# Altium schematic sheet KA2_3.SchDoc
size 420 x 297 mm; SheetNumber: 3; SheetTotal: 6
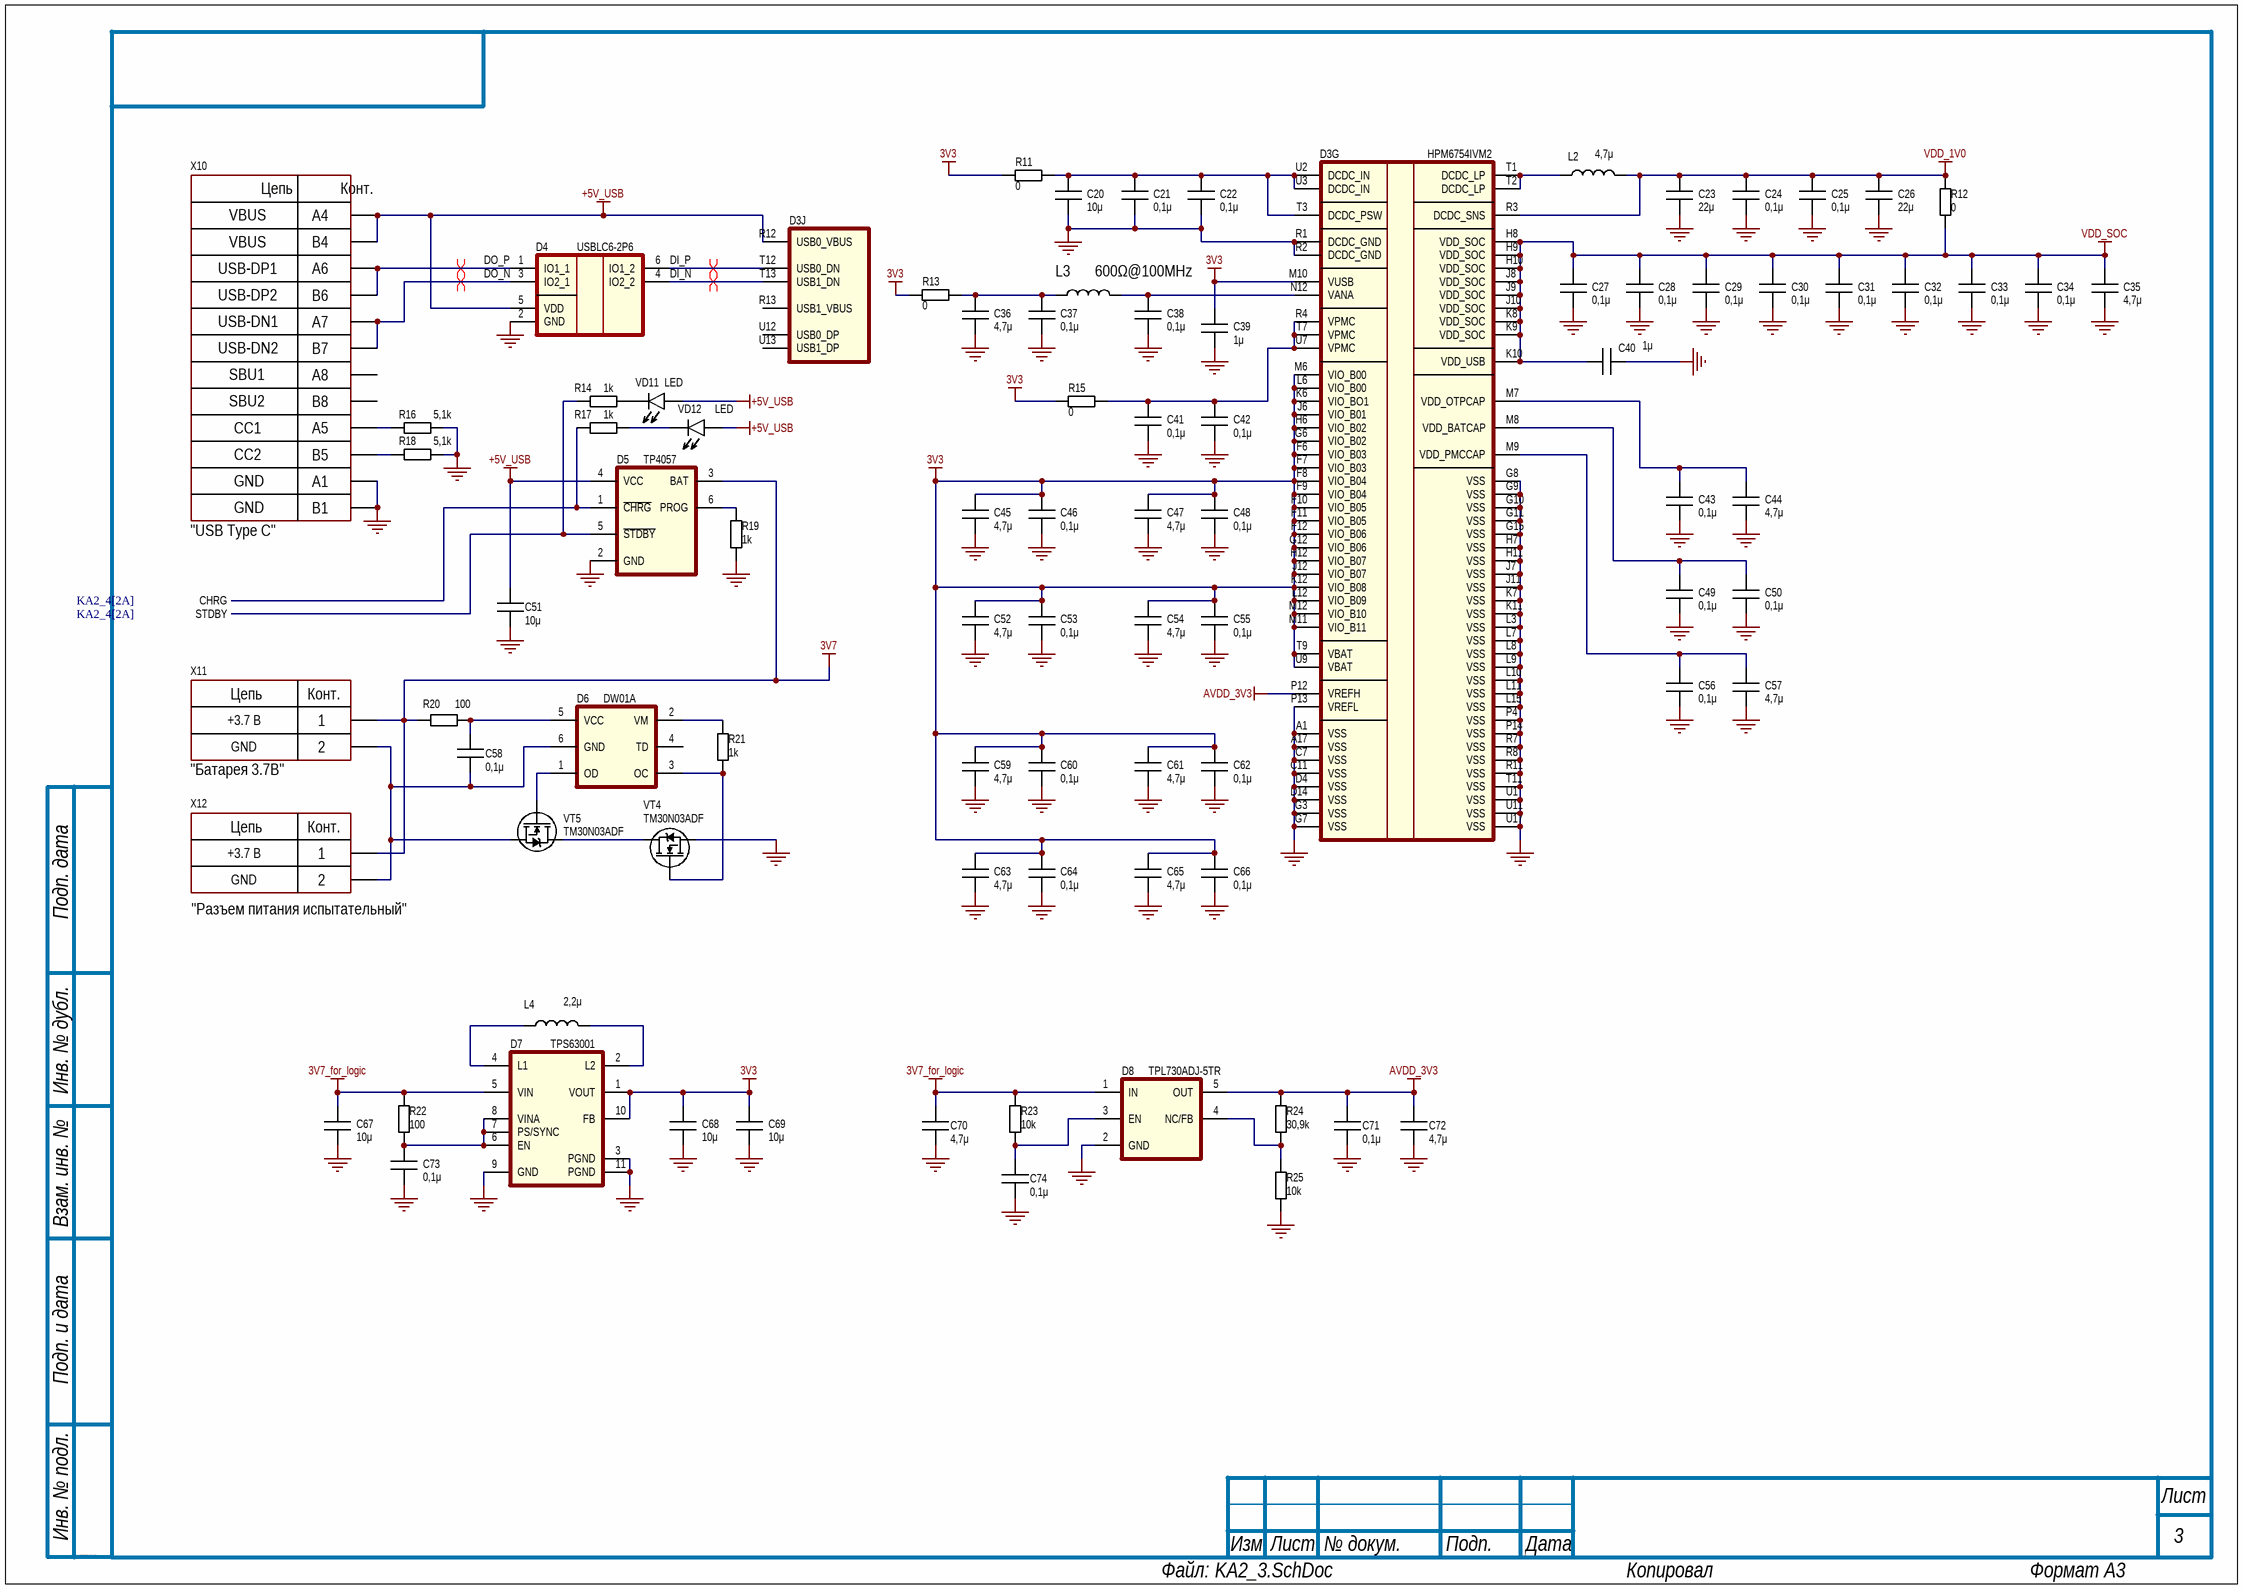
[diagram p0: KA2_3.SchDoc]

## Parts
C20  value 10μ  [Capacitor_0402]
C21  value 0,1μ  [Capacitor_0402]
C22  value 0,1μ  [Capacitor_0402]
C23  value 22μ  [Capacitor_0402]
C24  value 0,1μ  [Capacitor_0402]
C25  value 0,1μ  [Capacitor_0402]
C26  value 22μ  [Capacitor_0402]
C27  value 0,1μ  [Capacitor_0402]
C28  value 0,1μ  [Capacitor_0402]
C29  value 0,1μ  [Capacitor_0402]
C30  value 0,1μ  [Capacitor_0402]
C31  value 0,1μ  [Capacitor_0402]
C32  value 0,1μ  [Capacitor_0402]
C33  value 0,1μ  [Capacitor_0402]
C34  value 0,1μ  [Capacitor_0402]
C35  value 4,7μ  [Capacitor_0402]
C36  value 4,7μ  [Capacitor_0402]
C37  value 0,1μ  [Capacitor_0402]
C38  value 0,1μ  [Capacitor_0402]
C39  value 1μ  [Capacitor_0402]
C40  value 1μ  [Capacitor_0402]
C41  value 0,1μ  [Capacitor_0402]
C42  value 0,1μ  [Capacitor_0402]
C43  value 0,1μ  [Capacitor_0402]
C44  value 4,7μ  [Capacitor_0402]
C45  value 4,7μ  [Capacitor_0402]
C46  value 0,1μ  [Capacitor_0402]
C47  value 4,7μ  [Capacitor_0402]
C48  value 0,1μ  [Capacitor_0402]
C49  value 0,1μ  [Capacitor_0402]
C50  value 0,1μ  [Capacitor_0402]
C51  value 10μ  [Capacitor_0402]
C52  value 4,7μ  [Capacitor_0402]
C53  value 0,1μ  [Capacitor_0402]
C54  value 4,7μ  [Capacitor_0402]
C55  value 0,1μ  [Capacitor_0402]
C56  value 0,1μ  [Capacitor_0402]
C57  value 4,7μ  [Capacitor_0402]
C58  value 0,1μ  [Capacitor_0402]
C59  value 4,7μ  [Capacitor_0402]
C60  value 0,1μ  [Capacitor_0402]
C61  value 4,7μ  [Capacitor_0402]
C62  value 0,1μ  [Capacitor_0402]
C63  value 4,7μ  [Capacitor_0402]
C64  value 0,1μ  [Capacitor_0402]
C65  value 4,7μ  [Capacitor_0402]
C66  value 0,1μ  [Capacitor_0402]
C67  value 10μ  [Capacitor_0402]
C68  value 10μ  [Capacitor_0402]
C69  value 10μ  [Capacitor_0402]
C70  value 4,7μ  [Capacitor_0402]
C71  value 0,1μ  [Capacitor_0402]
C72  value 4,7μ  [Capacitor_0402]
C73  value 0,1μ  [Capacitor_0402]
C74  value 0,1μ  [Capacitor_0402]
D3  HPM6754IVM2  [HPM6754IVM2_BGA-289_14x14mm]  (parts G,J of 11)
D4  USBLC6-2P6  [SOT-666]
D5  TP4057  [SOT23-6]
D6  DW01A  [SOT23-6]
D7  TPS63001  [TPS6300x]
D8  value TPL730ADJ-5TR  [SOT-23-5]  (hidden comment: TPL730ADJ-5TL)
L2  value 4,7μ  [Inductor_1008]  (hidden comment: 1.55A 4.7uH ±20% 1.9A 196mΩ Magnetic Shielded Inductor 1008 Fixed Inductors RoHS)
L3  value 600Ω@100MHz  [IND: 0603]
L4  value 2,2μ  [Inductor_1008]  (hidden comment: 3A 2.2uH ±20% 55mΩ 3.8A 1008 Fixed Inductors RoHS)
R11  value 0  [RES: 0805]
R12  value 0  [RES: 0805]
R13  value 0  [RES: 0805]
R14  value 1k  [RES: 0402]
R15  value 0  [RES: 0805]
R16  value 5,1k  [RES: 0402]
R17  value 1k  [RES: 0402]
R18  value 5,1k  [RES: 0402]
R19  value 1k  [RES: 0402]
R20  value 100  [RES: 0402]
R21  value 1k  [RES: 0402]
R22  value 100  [RES: 0805]
R23  value 10k  [RES: 0402]
R24  value 30,9k  [RES: 0402]
R25  value 10k  [RES: 0402]
VD11  value LED  [LED: 0603Y]  (hidden comment: LED_0603_Y)
VD12  value LED  [LED: 0603Y]  (hidden comment: Red 625nm LED Indication - Discrete 2.3V 0603)
VT4  TM30N03ADF  [TM30N03ADF]
VT5  TM30N03ADF  [TM30N03ADF]
X10  CommentText: "USB Type C"  [CON: TYPE-C-31-M-12]  (hidden comment: USB-C (USB TYPE-C) Receptacle Connector 16 Position Surface Mount)
X11  "Батарея 3.7В"  [CONN_BATTERY_3V7_V2]  (no BOM)
X12  "Разъем питания испытательный"  [CONN_JST_XH_B2B-XH-A_1x02_P2.50mm]  (no BOM)

## Ports
CHRG (see KA2_4[2A]), STDBY (see KA2_4[2A])

## Nets
3V3: C39.2 C45.2 C46.2 C47.2 C48.2 C52.2 C53.2 C54.2 C55.2 C59.2 C60.2 C61.2 C62.2 C63.2 C64.2 C65.2 C66.2 C68.2 C69.2 D3.F6(VIO_B03) D3.F7(VIO_B03) D3.F8(VIO_B04) D3.F9(VIO_B04) D3.F10(VIO_B05) D3.F11(VIO_B05) D3.F12(VIO_B06) D3.G6(VIO_B02) D3.G12(VIO_B06) D3.H6(VIO_B02) D3.H12(VIO_B07) D3.J6(VIO_B01) D3.J12(VIO_B07) D3.K6(VIO_BO1) D3.K12(VIO_B08) D3.L6(VIO_B00) D3.L12(VIO_B09) D3.M6(VIO_B00) D3.M10(VUSB) D3.M11(VIO_B11) D3.M12(VIO_B10) D3.T9(VBAT) D3.U9(VBAT) D7.1(VOUT) D7.10(FB) R11.2 R13.2 R15.2
3V7: D5.3(BAT) R20.1 X11.1 X12.1
3V7_for_logic: C67.2 C70.2 D7.5(VIN) D8.1(IN) R22.1 R23.2
+5V_USB: C51.2 D3.R12(USB0_VBUS) D4.5(VDD) D5.4(VCC) VD11.A(Anode) VD12.A(Anode) X10.A4 X10.B4
AVDD_3V3: C71.2 C72.2 D3.P12(VREFH) D8.5(OUT) R24.2
GND: C20.1 C21.1 C22.1 C23.1 C24.1 C25.1 C26.1 C27.1 C28.1 C29.1 C30.1 C31.1 C32.1 C33.1 C34.1 C35.1 C36.1 C37.1 C38.1 C39.1 C40.1 C41.1 C42.1 C43.1 C44.1 C45.1 C46.1 C47.1 C48.1 C49.1 C50.1 C51.1 C52.1 C53.1 C54.1 C55.1 C56.1 C57.1 C59.1 C60.1 C61.1 C62.1 C63.1 C64.1 C65.1 C66.1 C67.1 C68.1 C69.1 C70.1 C71.1 C72.1 C73.1 C74.1 D3.A1(VSS) D3.A17(VSS) D3.C7(VSS) D3.C11(VSS) D3.D4(VSS) D3.D14(VSS) D3.G3(VSS) D3.G7(VSS) D3.G8(VSS) D3.G9(VSS) D3.G10(VSS) D3.G11(VSS) D3.G15(VSS) D3.H7(VSS) D3.H11(VSS) D3.J7(VSS) D3.J11(VSS) D3.K7(VSS) D3.K11(VSS) D3.L3(VSS) D3.L7(VSS) D3.L8(VSS) D3.L9(VSS) D3.L10(VSS) D3.L11(VSS) D3.L15(VSS) D3.P4(VSS) D3.P13(VREFL) D3.P14(VSS) D3.R1(DCDC_GND) D3.R2(DCDC_GND) D3.R7(VSS) D3.R8(VSS) D3.R11(VSS) D3.T11(VSS) D3.U1(VSS) D3.U11(VSS) D3.U17(VSS) D4.2(GND) D5.2(GND) D7.3(PGND) D7.9(GND) D7.11(PGND) D8.2(GND) R16.2 R18.2 R19.1 R25.1 VT4.S X10.A1 X10.B1
VDD_1V0: C23.2 C24.2 C25.2 C26.2 D3.R3(DCDC_SNS) L2.1 R12.2
VDD_SOC: C27.2 C28.2 C29.2 C30.2 C31.2 C32.2 C33.2 C34.2 C35.2 C40.2 D3.H8(VDD_SOC) D3.H9(VDD_SOC) D3.H10(VDD_SOC) D3.J8(VDD_SOC) D3.J9(VDD_SOC) D3.J10(VDD_SOC) D3.K8(VDD_SOC) D3.K9(VDD_SOC) D3.K10(VDD_USB) R12.1
CHRG: D5.1(~{CHRG}) R17.1 ; port CHRG
DI_N: D3.T13(USB1_DN) D4.4(IO2_2)
DI_P: D3.T12(USB0_DN) D4.6(IO1_2)
DO_N: D4.3(IO2_1) X10.A7 X10.B7
DO_P: D4.1(IO1_1) X10.A6 X10.B6
STDBY: D5.5(~{STDBY}) R14.1 ; port STDBY
NetC20_2: C20.2 C21.2 C22.2 D3.T3(DCDC_PSW) D3.U2(DCDC_IN) D3.U3(DCDC_IN) R11.1
NetC36_2: C36.2 C37.2 L3.2 R13.1
NetC38_2: C38.2 D3.N12(VANA) L3.1
NetC41_2: C41.2 C42.2 D3.R4(VPMC) D3.T7(VPMC) D3.U7(VPMC) R15.1
NetC43_2: C43.2 C44.2 D3.M7(VDD_OTPCAP)
NetC49_2: C49.2 C50.2 D3.M8(VDD_BATCAP)
NetC56_2: C56.2 C57.2 D3.M9(VDD_PMCCAP)
NetC58_1: C58.1 D6.6(GND) VT5.S X11.2 X12.2
NetC58_2: C58.2 D6.5(VCC) R20.2
NetC73_2: C73.2 D7.6(EN) D7.7(PS/SYNC) D7.8(VINA) R22.2
NetC74_2: C74.2 D8.3(EN) R23.1
NetD3_T1: D3.T1(DCDC_LP) D3.T2(DCDC_LP) L2.2
NetD5_6: D5.6(PROG) R19.2
NetD6_1: D6.1(OD) VT5.G
NetD6_2: D6.2(VM) R21.2
NetD6_3: D6.3(OC) R21.1 VT4.G
NetD7_2: D7.2(L2) L4.1
NetD7_4: D7.4(L1) L4.2
NetD8_4: D8.4(NC/FB) R24.1 R25.2
NetR14_2: R14.2 VD11.K(Kathode)
NetR16_1: R16.1 X10.A5
NetR17_2: R17.2 VD12.K(Kathode)
NetR18_1: R18.1 X10.B5
NetVT4_D: VT4.D VT5.D

Not connected (* = marked no-connect by the designer): D3 R13(USB1_VBUS) U12(USB0_DP) U13(USB1_DP); D6 4(TD); X10 A8 B8

## Layout directives
differential pair: DI_N, DI_P, DO_N, DO_P

## Notes on the sheet
- +3.7 В
- GND
- Подп. дата
- Инв. № дубл.
- Взам. инв. №
- Подп. и дата
- Инв. № подл.
- Изм.
- Лист
- № докум.
- Подп.
- Дата
- ALTIUM GOSTBOM2.0 KEV
- Файл:
- Копировал
- Формат А3
- (in symbol Connector_Battery) Цепь; Конт.; +3.7 В; GND
- (in symbol Connector_JST_XH_B2B-XH-A_1x02_2.50mm) Цепь; Конт.
- (in symbol Connector_USB_Type_C) Цепь; Конт.; VBUS; USB-DP1; USB-DP2; USB-DN1; USB-DN2; SBU1; SBU2; CC1; CC2; GND

## Library data of the parts
C20 C51 C67-C69 = Ceramic_0402: ValueManufacturerPartNumber: Ceramic capacitor, 10μ, X7R, ±10%, 16V, 0402; TypeCapacitor: Ceramic capacitor; Tolerance: ±10%; TypeDielectric: X7R; Voltage: 16V; Manufacturer: *; HelpURL: *; Package: 0402; Mfr.Part: *
C21 C22 C24 C25 C27-C34 C37 C38 C41-C43 C46 C48-C50 C53 C55 C56 C58 C60 C62 C64 C66 C71 C73 C74 = Ceramic_0402: ValueManufacturerPartNumber: Ceramic capacitor, 0,1μ, X7R, ±10%, 16V, 0402; TypeCapacitor: Ceramic capacitor; Tolerance: ±10%; TypeDielectric: X7R; Voltage: 16V; Manufacturer: *; HelpURL: *; Package: 0402; Mfr.Part: *
C23 C26 = Ceramic_0402: ValueManufacturerPartNumber: Ceramic capacitor, 22μ, X7R, ±10%, 16V, 0402; TypeCapacitor: Ceramic capacitor; Tolerance: ±10%; TypeDielectric: X7R; Voltage: 16V; Manufacturer: *; HelpURL: *; Package: 0402; Mfr.Part: *
C35 C36 C44 C45 C47 C52 C54 C57 C59 C61 C63 C65 C70 C72 = Ceramic_0402: ValueManufacturerPartNumber: Ceramic capacitor, 4,7μ, X7R, ±10%, 16V, 0402; TypeCapacitor: Ceramic capacitor; Tolerance: ±10%; TypeDielectric: X7R; Voltage: 16V; Manufacturer: *; HelpURL: *; Package: 0402; Mfr.Part: *
C39 C40 = Ceramic_0402: ValueManufacturerPartNumber: Ceramic capacitor, 1μ, X7R, ±10%, 16V, 0402; TypeCapacitor: Ceramic capacitor; Tolerance: ±10%; TypeDielectric: X7R; Voltage: 16V; Manufacturer: *; HelpURL: *; Package: 0402; Mfr.Part: *
D3 = HPM6754IVM2: Микроконтроллер RISC-V, 2xRV32GCBP@816МГц, 2МБ ОЗУ, BGA-289 14x14mm; Manufacturer: HPMICRO; Mfr.Part: HPM6754IVM2; Value: HPM6754IVM2; HelpURL: https://www.lcsc.com/product-detail/C49451874.html
D4 = USBLC6-2P6: Микросхема защиты USB от статики, SOT-666; Manufacturer: STMicroelectronics; Mfr.Part: USBLC6-2P6; Value: USBLC6-2P6; HelpURL: https://www.lcsc.com/product-detail/C15999.html
D5 = TP4057: Микросхема зарядки li-ion барареи, SOT-23-6; Manufacturer: JSMSEMI; Mfr.Part: TP4057; Value: TP4057; HelpURL: https://www.lcsc.com/product-detail/C20606861.html
D6 = DW01A: Микросхема защиты li-ion-батареи; Mfr.Part: DW01A-JSM; Manufacturer: JSMSEMI; Value: DW01A; HelpURL: https://www.lcsc.com/product-detail/C39846919.html
D7 = TPS63001: Микросхема драйвера повышающе-понижающего преобразователя, вход 1,8...5,5В, выход 3,3В, 800-1200мА; Mfr.Part: TPS63001DRCR; Manufacturer: Texas Instruments; Value: TPS63001; HelpURL: https://www.lcsc.com/product-detail/C28060.html
D8 = TPL730ADJ-5TL: Микросхема драйвера импульсного понижающего преобразователя; Manufacturer: 3PEAK; Mfr.Part: TPL730ADJ-5TR; HelpURL: https://www.lcsc.com/product-detail/C2690181.html
L2 = Inductor_FWP252012P-4R7ML: Manufacturer: cjiang; Mfr.Part: FWP252012P-4R7ML; HelpURL: https://www.lcsc.com/product-detail/C5179447.html
L3 = Inductor_0603: ValueManufacturerPartNumber: Inductor, 600Ω@100MHz, ±10%, 0603; Tolerance: ±10%; Manufacturer: *; Mfr.Part: *; Package: 0603; HelpURL: *; TypeInductor: Inductor
L4 = Inductor_FTC252012S2R2MBCA: Manufacturer: cjiang; Mfr.Part: FTC252012S2R2MBCA; HelpURL: https://www.lcsc.com/product-detail/C5832372.html
R11-R13 R15 = Resistor_0805: ValueManufacturerPartNumber: Resistor, 0, ±1%, 0805; Tolerance: ±1%; Manufacturer: *; Package: 0805; HelpURL: *; TypeResistor: Resistor; Mfr.Part: *
R14 R17 R21 = Resistor_0402: ValueManufacturerPartNumber: Resistor, 1k, ±1%, 0402; Tolerance: ±1%; Manufacturer: *; Package: 0402; Mfr.Part: *; TypeResistor: Resistor; HelpURL: *
R16 R18 = Resistor_0402: ValueManufacturerPartNumber: Resistor, 5,1k, ±1%, 0402; Tolerance: ±1%; Manufacturer: *; Package: 0402; Mfr.Part: *; TypeResistor: Resistor; HelpURL: *
R19 = Resistor_0402: Manufacturer: Yageo; ValueManufacturerPartNumber: Resistor, 1k, ±1%, 0402; Tolerance: ±1%; Package: 0402; TypeResistor: Resistor
R20 = Resistor_0402: ValueManufacturerPartNumber: Resistor, 100, ±1%, 0402; Tolerance: ±1%; Manufacturer: *; Package: 0402; Mfr.Part: *; TypeResistor: Resistor; HelpURL: *
R22 = Resistor_0805: ValueManufacturerPartNumber: Resistor, 100, ±1%, 0805; Tolerance: ±1%; Manufacturer: *; Package: 0805; HelpURL: *; TypeResistor: Resistor; Mfr.Part: *
R23 R25 = Resistor_0402: ValueManufacturerPartNumber: Resistor, 10k, ±1%, 0402; Tolerance: ±1%; Manufacturer: *; Package: 0402; Mfr.Part: *; TypeResistor: Resistor; HelpURL: *
R24 = Resistor_0402: ValueManufacturerPartNumber: Resistor, 30,9k, ±1%, 0402; Tolerance: ±1%; Manufacturer: *; Package: 0402; Mfr.Part: *; TypeResistor: Resistor; HelpURL: *
VD11 = LED_0603_Y: Светодиод желтый, 0603; Mfr.Part: TJ-S1608CY6T5ALC9Y-A5; Manufacturer: TOGIALED; HelpURL: https://www.lcsc.com/product-detail/C2837010.html
VD12 = LED_0603_R: Светодиод красный, 0603; Mfr.Part: XL-1608SURC-06; Manufacturer: XINGLIGHT; HelpURL: https://www.lcsc.com/product-detail/C965799.html
VT4 VT5 = TM30N03ADF: Транзистор N-канальный, 30В 30А 15Вт, DFN3x3-8; Manufacturer: Tritech-MOS; Mfr.Part: TM30N03ADF; Value: TM30N03ADF; HelpURL: https://www.lcsc.com/product-detail/C7422839.html
X10 = Connector_USB_Type_C: 16-pin USB-C connector, surface mount; Manufacturer: HDGC; Mfr.Part: TYPE C-DB-116PWB; HelpURL: https://www.lcsc.com/product-detail/C7395062.html
X11 = Connector_Battery
X12 = Connector_JST_XH_B2B-XH-A_1x02_2.50mm